# Altium schematic sheet MB989.SchDoc
size A4; Revision: B.1
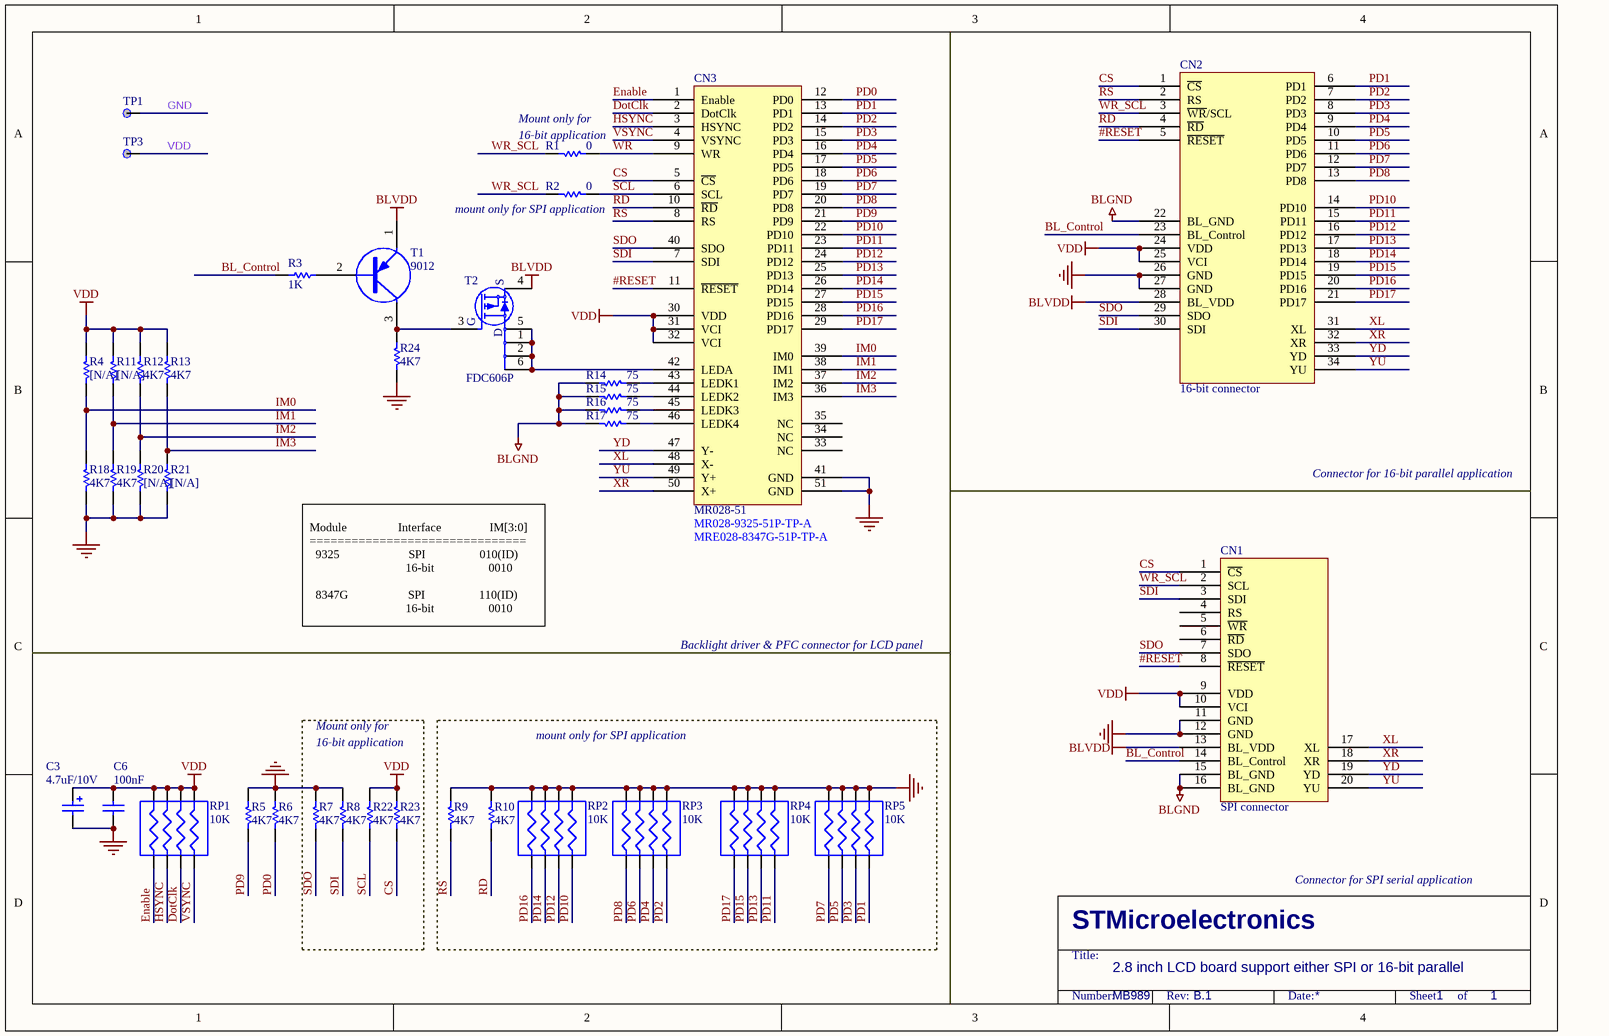
[diagram p0: MB989.SchDoc]

## Parts
C3  4.7uF/10V  [TAN-A]
C6  100nF  [0603C]
CN1  SPI connector  [AM240320A]
CN2  16-bit connector  [2*17P]
CN3  MR028-51  [XF2B-5145]
R1  0  [0603R]
R2  0  [0603R]
R3  1K  [0603R]
R4  [N/A]  [0603R]
R5  4K7  [0603R]
R6  4K7  [0603R]
R7  4K7  [0603R]
R8  4K7  [0603R]
R9  4K7  [0603R]
R10  4K7  [0603R]
R11  [N/A]  [0603R]
R12  4K7  [0603R]
R13  4K7  [0603R]
R14  75  [0603R]
R15  75  [0603R]
R16  75  [0603R]
R17  75  [0603R]
R18  4K7  [0603R]
R19  4K7  [0603R]
R20  [N/A]  [0603R]
R21  [N/A]  [0603R]
R22  4K7  [0603R]
R23  4K7  [0603R]
R24  4K7  [0603R]
RP1  10K  [RES-4B]
RP2  10K  [RES-4B]
RP3  10K  [RES-4B]
RP4  10K  [RES-4B]
RP5  10K  [RES-4B]
T1  9012  [SOT-23]
T2  FDC606P  [SOT23-6L]
TP1  (no value)  [TP]
TP3  (no value)  [TP]

## Blocks framed on the sheet
mount only for SPI application: R9 R10 RP2-RP5

## Nets
BLGND: CN1.15(BL_GND) CN1.16(BL_GND) CN2.22(BL_GND) R14.2 R15.2 R16.2 R17.2
BLVDD: CN1.13(BL_VDD) CN2.28(BL_VDD) T1.1(E) T2.4(S)
GND: C3.2 C6.1 CN1.11(GND) CN1.12(GND) CN2.26(GND) CN2.27(GND) CN3.41(GND) CN3.51(GND) R5.1 R6.1 R7.1 R8.1 R9.1 R10.1 R18.2 R19.2 R20.2 R21.2 R24.2 RP2.2(R1) RP2.4(R3) RP2.6(R2) RP2.8(R0) RP3.2(R1) RP3.4(R3) RP3.6(R2) RP3.8(R0) RP4.2(R1) RP4.4(R3) RP4.6(R2) RP4.8(R0) RP5.2(R1) RP5.4(R3) RP5.6(R2) RP5.8(R0) TP1.1
VDD: C3.1 C6.2 CN1.9(VDD) CN1.10(VCI) CN2.24(VDD) CN2.25(VCI) CN3.30(VDD) CN3.31(VCI) CN3.32(VCI) R4.1 R11.1 R12.1 R13.1 R22.1 R23.1 RP1.2(R1) RP1.4(R3) RP1.6(R2) RP1.8(R0) TP3.1
#RESET: CN1.8(~{RESET}) CN2.5(~{RESET}) CN3.11(~{RESET})
BL_Control: CN1.14(BL_Control) CN2.23(BL_Control) R3.2
CS: CN1.1(~{CS}) CN2.1(~{CS}) CN3.5(~{CS}) R23.2
DotClk: CN3.2(DotClk) RP1.5(R3)
Enable: CN3.1(Enable) RP1.1(R0)
HSYNC: CN3.3(HSYNC) RP1.3(R2)
IM0: CN3.39(IM0) R4.2 R18.1
IM1: CN3.38(IM1) R11.2 R19.1
IM2: CN3.37(IM2) R12.2 R20.1
IM3: CN3.36(IM3) R13.2 R21.1
PD0: CN3.12(PD0) R6.2
PD1: CN2.6(PD1) CN3.13(PD1) RP5.7(R1)
PD2: CN2.7(PD2) CN3.14(PD2) RP3.7(R1)
PD3: CN2.8(PD3) CN3.15(PD3) RP5.5(R3)
PD4: CN2.9(PD4) CN3.16(PD4) RP3.5(R3)
PD5: CN2.10(PD5) CN3.17(PD5) RP5.3(R2)
PD6: CN2.11(PD6) CN3.18(PD6) RP3.3(R2)
PD7: CN2.12(PD7) CN3.19(PD7) RP5.1(R0)
PD8: CN2.13(PD8) CN3.20(PD8) RP3.1(R0)
PD9: CN3.21(PD9) R5.2
PD10: CN2.14(PD10) CN3.22(PD10) RP2.7(R1)
PD11: CN2.15(PD11) CN3.23(PD11) RP4.7(R1)
PD12: CN2.16(PD12) CN3.24(PD12) RP2.5(R3)
PD13: CN2.17(PD13) CN3.25(PD13) RP4.5(R3)
PD14: CN2.18(PD14) CN3.26(PD14) RP2.3(R2)
PD15: CN2.19(PD15) CN3.27(PD15) RP4.3(R2)
PD16: CN2.20(PD16) CN3.28(PD16) RP2.1(R0)
PD17: CN2.21(PD17) CN3.29(PD17) RP4.1(R0)
RD: CN2.4(~{RD}) CN3.10(~{RD}) R10.2
RS: CN2.2(RS) CN3.8(RS) R9.2
SCL: CN3.6(SCL) R2.1 R22.2
SDI: CN1.3(SDI) CN2.30(SDI) CN3.7(SDI) R8.2
SDO: CN1.7(SDO) CN2.29(SDO) CN3.40(SDO) R7.2
VSYNC: CN3.4(VSYNC) RP1.7(R1)
WR: CN3.9(WR) R1.1
WR_SCL: CN1.2(SCL) CN2.3(~{WR}/SCL) R1.2 R2.2
XL: CN1.17(XL) CN2.31(XL) CN3.48(X-)
XR: CN1.18(XR) CN2.32(XR) CN3.50(X+)
YD: CN1.19(YD) CN2.33(YD) CN3.47(Y-)
YU: CN1.20(YU) CN2.34(YU) CN3.49(Y+)
NetCN3_42: CN3.42(LEDA) T2.1(D) T2.2(D) T2.5(D) T2.6(D)
NetCN3_43: CN3.43(LEDK1) R14.1
NetCN3_44: CN3.44(LEDK2) R15.1
NetCN3_45: CN3.45(LEDK3) R16.1
NetCN3_46: CN3.46(LEDK4) R17.1
NetR3_1: R3.1 T1.2(B)
NetR24_1: R24.1 T1.3(C) T2.3(G)

Not connected (* = marked no-connect by the designer): CN1 4(RS) 5(~{WR}) 6(~{RD}); CN3 33(NC) 34(NC) 35(NC)

## Notes on the sheet
- (near R1) Mount only for
- (near R1) 16-bit application
- (near R2) mount only for SPI application
- Connector for 16-bit parallel application
- (near CN3) MRE028-8347G-51P-TP-A
- (near CN3) MR028-9325-51P-TP-A
- Module                 Interface                IM[3:0]
  ===============================
  9325                       SPI                  010(ID)
  16-bit                  0010
  8347G                    SPI                  110(ID)
  16-bit                  0010
- Backlight driver & PFC connector for LCD panel
- Mount only for
- 16-bit application
- Connector for SPI serial application
- 2.8 inch LCD board support either SPI or 16-bit parallel
- MB989
- 1
- STMicroelectronics
- Title:
- Number:
- Rev:
- Date:
- Sheet       of

## Library data of the parts
C3 = Cap Pol1: Polarized Capacitor (Radial); Value: 100pF; Published: 8-Jun-2000; Revision: July-2002: Re-released for DXP Platform.; Publisher: Altium Limited
C6 = CAP: Capacitor; Value: 100pF; Published: 8-Jun-2000; Revision: July-2002: Re-released for DXP Platform.; Publisher: Altium Limited
CN1 = ColorLCD_module_SPI
CN2 = ColorLCD_module_16bits
CN3 = MR028-9325-51P-TP-A
R1 R2 R4-R24 = Res1: Resistor; Value: 1K; Published: 8-Jun-2000; Revision: July-2002: Re-released for DXP Platform.; Publisher: Altium Limited
R3 = Res1: Resistor; Published: 8-Jun-2000; Revision: July-2002: Re-released for DXP Platform.; Publisher: Altium Limited; Value: 1K
RP1-RP5 = RES4B
T1 = PNP
T2 = STT5PF20V
TP1 TP3 = TP